# Altium schematic sheet MCU.SchDoc
size A4
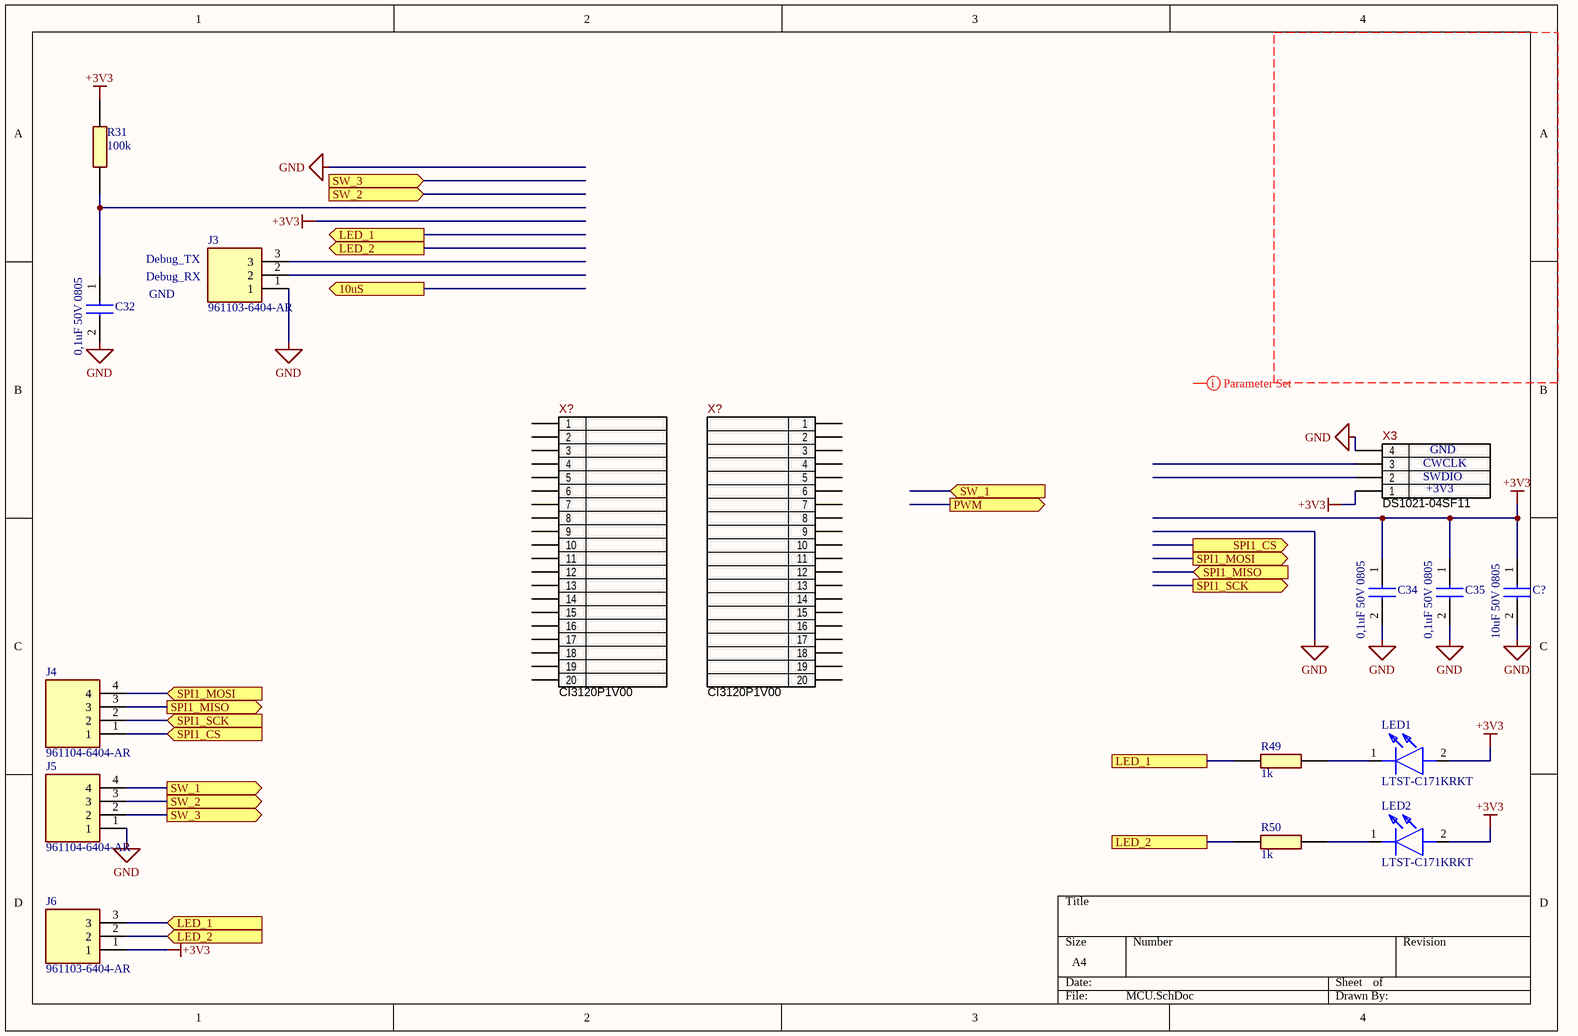
[diagram p0: MCU.SchDoc]

## Parts
(Parts that share a designator on the sheet are numbered #1, #2 ... from top to bottom, then left to right.)
C32  0,1uF 50V 0805  [CAPC2012X90N]
C34  0,1uF 50V 0805  [CAPC2012X90N]
C35  0,1uF 50V 0805  [CAPC2012X90N]
C?  10uF 50V 0805  [CAPC2012X90N]
J3  961103-6404-AR  [HDRV3W64P0X254_1X3_762X250X1050P]
J4  961104-6404-AR  [HDRV4W64P0X254_1X4_1016X250X800P]
J5  961104-6404-AR  [HDRV4W64P0X254_1X4_1016X250X800P]
J6  961103-6404-AR  [HDRV3W64P0X254_1X3_762X250X1050P]
LED1  LTST-C171KRKT  [LEDM2012X90N]
LED2  LTST-C171KRKT  [LEDM2012X90N]
R31  100k  [RESC2013X65N]
R49  1k  [RESC2013X65N]
R50  1k  [RESC2013X65N]
X3  Part Number: DS1021-04SF11  [DS1021-04S]  (hidden comment: PLS-4 (Part of PLS-40))
X?#1  Part Number: CI3120P1V00  [WF-20S]  (hidden comment: WH-20S)
X?#2  Part Number: CI3120P1V00  [WF-20S]  (hidden comment: WH-20S)

## Ports
10uS (out), LED_1, LED_1 (in), LED_1 (out), LED_2, LED_2 (in), LED_2 (out), PWM (out), SPI1_CS (in), SPI1_CS (out), SPI1_MISO (in), SPI1_MISO (out), SPI1_MOSI (in), SPI1_MOSI (out), SPI1_SCK (in), SPI1_SCK (out), SW_1 (in), SW_1 (out), SW_2 (in), SW_2 (out), SW_3 (in), SW_3 (out)

## Nets
+3V3: C34.1 C35.1 C?.1 J6.1 LED1.2(A) LED2.2(A) R31.2 X3.1
GND: C32.2 C34.2 C35.2 C?.2 J3.1 J5.1 X3.4
LED_1: J6.3 R49.2 ; port LED_1
LED_2: J6.2 R50.2 ; port LED_2
SPI1_CS: J4.1 ; port SPI1_CS
SPI1_MISO: J4.3 ; port SPI1_MISO
SPI1_MOSI: J4.4 ; port SPI1_MOSI
SPI1_SCK: J4.2 ; port SPI1_SCK
SW_1: J5.4 ; port SW_1
SW_2: J5.3 ; port SW_2
SW_3: J5.2 ; port SW_3
NetC32_1: C32.1 R31.1
NetLED1_1: LED1.1(K) R49.1
NetLED2_1: LED2.1(K) R50.1

Not connected (* = marked no-connect by the designer): J3 2 3; X3 2 3; X?#1 1 2 3 4 5 6 7 8 9 10 11 12 13 14 15 16 17 18 19 20; X?#2 1 2 3 4 5 6 7 8 9 10 11 12 13 14 15 16 17 18 19 20

## Layout directives
net class NET_MCU: (no net found under the mark)

## Notes on the sheet
- Debug_TX
- Debug_RX
- (near C32) GND
- (near X3) SWDIO
- (near X3) CWCLK
- (near X3) +3V3
- (near X3) GND

## Library data of the parts
C32 C34 C35 C? = MCMT21N470F250CT: Capacitor; Height: 0.9mm
J3 J6 = 961103-6404-AR: Connector; Manufacturer_Name: 3M; Datasheet Link: https://datasheet.datasheetarchive.com/originals/distributors/Datasheets-DGA21/2082015.pdf; Height: 10.5mm; Manufacturer_Part_Number: 961103-6404-AR; Mouser Part Number: 517-9611036404AR; Mouser Price/Stock: https://www.mouser.co.uk/ProductDetail/3M-Electronic-Solutions-Division/961103-6404-AR?qs=A%252BtsDZJT%252Bi8c%252BGQWaXFlLA%3D%3D
J4 J5 = 961104-6404-AR: Connector; Manufacturer_Name: 3M; Datasheet Link: https://componentsearchengine.com/Datasheets/1/961104-6404-AR.pdf; Height: 8mm; Manufacturer_Part_Number: 961104-6404-AR; Mouser Part Number: 517-9611046404AR; Mouser Price/Stock: https://www.mouser.co.uk/ProductDetail/3M-Electronic-Solutions-Division/961104-6404-AR?qs=A%252BtsDZJT%252Bi%2F2kLigPy7HDA%3D%3D
LED1 LED2 = LTST-C171KRKT: LED; Manufacturer_Name: Lite-On; Datasheet Link: http://www.mouser.com/datasheet/2/239/Lite-On-LTST-C171KRKT-1175280.pdf; Height: 0.9mm; Manufacturer_Part_Number: LTST-C171KRKT; Mouser Part Number: 859-LTST-C171KRKT; Mouser Price/Stock: https://www.mouser.co.uk/ProductDetail/Lite-On/LTST-C171KRKT?qs=5XMAZBf2SiSTcAb1f5vDzw%3D%3D; Arrow Part Number: LTST-C171KRKT; Arrow Price/Stock: https://www.arrow.com/en/products/ltst-c171krkt/lite-on-technology?region=nac
R31 R49 R50 = ERJP06J822V: Resistor; Height: 0.7mm
X3 = DS1021-04SF11: 4 Pin 2.54mm Male Header, Vertical, 3mm and 6.1mm, PLS-4; Manufacturer: Connfly; Ajax_1C_ID: 1215; Ajax_1C_PN: PLS40, планки со штырьками; Ajax_1С_Status: Mass Production; Replacement: NONE; Part Type: Header / Male Pin / Single Row; Component Type: PTH; Temperature Range: -40°C ~ 105°C; ComponentLink1URL: \\altiumdb.ajax.local\files\Datasheet\Connectors\DS1021.pdf; Price: 0,001875; ComponentLink1Description: Datasheet
X?#1 X?#2 = CI3120P1V00: WH Series 2.54mm Wire to Board Straight DIP Type Headers, 20 Pin; Manufacturer: CviLux; Ajax_1C_PN: NONE; Ajax_1С_Status: RND Only; Part Type: Wire-to-Board / Header; Component Type: PTH; Temperature Range: -25℃ ~ 85℃; ComponentLink1URL: https://www.cvilux.com/uploads/drawings/100/723/CI3102S.pdf; Replacement: NONE; Price: NONE; ComponentLink1Description: Datasheet